# Altium project PCB_ArduinoNano.PrjPcb
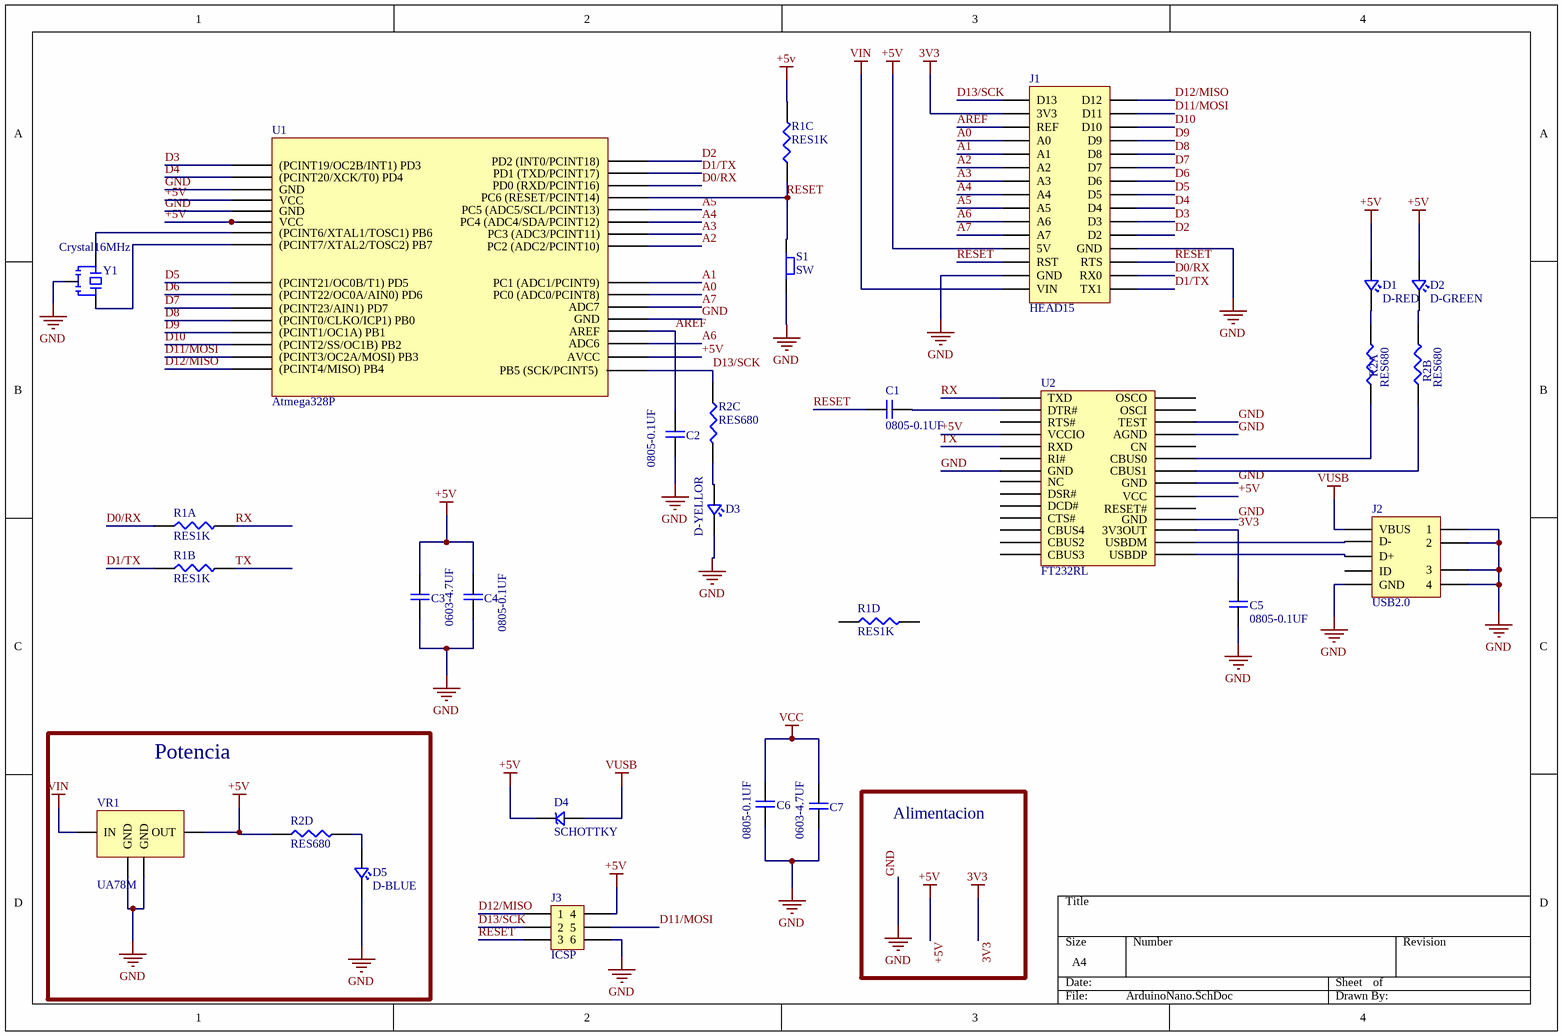
[diagram p0: ArduinoNano.SchDoc]
1 sheet, 22 parts. Net scope: global (net labels, ports and power ports of the same name join across sheets).
Board file: ArduinoNano.PcbDoc

## Sheet ArduinoNano.SchDoc
size A4

### Parts
C1  0805-0.1UF  [CAP CER0805]
C2  0805-0.1UF  [CAP CER0805]
C3  0603-4.7UF  [CAP CER0603]
C4  0805-0.1UF  [CAP CER0805]
C5  0805-0.1UF  [CAP CER0805]
C6  0805-0.1UF  [CAP CER0805]
C7  0603-4.7UF  [CAP CER0603]
D1  D-RED  [LEDR0805]
D2  D-GREEN  [LEDG0805]
D3  D-YELLOR  [LEDY0805]
D4  SCHOTTKY  [Diode Schottky]
D5  D-BLUE  [LEDB0805]
J1  HEAD15  [Headersx1]
J2  USB2.0  [USB-MINI_B]
J3  ICSP  [Headers2x3]
R1  RES1K  [RES1KX41206]  (parts A,B,C,D of 4)
R2  RES680  [RES680x4]  (parts A,B,C,D of 4)
S1  SW  [Switch]
U1  Atmega328P  [TQFP80P900X900X120-32N]
U2  FT232RL  [FT232]
VR1  UA78M  [UA78M]
Y1  Crystal16MHz  [Cristal]

### Blocks framed on the sheet
Potencia: D5 R2 VR1

### Nets
3V3: C5.1 J1.3V3 U2.17(3V3OUT)
+5V: C3.2 C4.2 D1.1 D2.1 D4.1 J1.5V J3.4 R1.6 R2.7 U1.4(VCC) U1.6(VCC) U1.18(AVCC) U2.4(VCCIO) U2.20(VCC) VR1.3(OUT)
GND: C2.1 C3.1 C4.1 C5.2 C6.2 C7.1 D3.2 D5.2 J1.GND J2.1 J2.2 J2.3 J2.4 J2.GND J3.6 S1.2 U1.3(GND) U1.5(GND) U1.21(GND) U2.7(GND) U2.18(GND) U2.21(GND) U2.25(AGND) U2.26(TEST) VR1.2(GND) VR1.4(GND) Y1.2
VCC: C6.1 C7.2
VIN: J1.VIN VR1.1(IN)
VUSB: D4.2 J2.VBUS
A0: J1.A0 U1.23(PC0_(ADC0/PCINT8))
A1: J1.A1 U1.24(PC1_(ADC1/PCINT9))
A2: J1.A2 U1.25(PC2_(ADC2/PCINT10))
A3: J1.A3 U1.26(PC3_(ADC3/PCINT11))
A4: J1.A4 U1.27(PC4_(ADC4/SDA/PCINT12))
A5: J1.A5 U1.28(PC5_(ADC5/SCL/PCINT13))
A6: J1.A6 U1.19(ADC6)
A7: J1.A7 U1.22(ADC7)
AREF: C2.2 J1.REF U1.20(AREF)
D0/RX: J1.RX0 R1.1 U1.30(PD0_(RXD/PCINT16))
D1/TX: J1.TX1 R1.3 U1.31(PD1_(TXD/PCINT17))
D2: J1.D2 U1.32(PD2_(INT0/PCINT18))
D3: J1.D3 U1.1((PCINT19/OC2B/INT1)_PD3)
D4: J1.D4 U1.2((PCINT20/XCK/T0)_PD4)
D5: J1.D5 U1.9((PCINT21/OC0B/T1)_PD5)
D6: J1.D6 U1.10((PCINT22/OC0A/AIN0)_PD6)
D7: J1.D7 U1.11((PCINT23/AIN1)_PD7)
D8: J1.D8 U1.12((PCINT0/CLKO/ICP1)_PB0)
D9: J1.D9 U1.13((PCINT1/OC1A)_PB1)
D10: J1.D10 U1.14((PCINT2/SS/OC1B)_PB2)
D11/MOSI: J1.D11 J3.5 U1.15((PCINT3/OC2A/MOSI)_PB3)
D12/MISO: J1.D12 J3.1 U1.16((PCINT4/MISO)_PB4)
D13/SCK: J1.D13 J3.2 R2.5 U1.17(PB5_(SCK/PCINT5))
RESET: C1.1 J1.RST J3.3 R1.5 S1.1 U1.29(PC6_(RESET/PCINT14))
RX: R1.2 U2.1(TXD)
TX: R1.4 U2.5(RXD)
NetC1_2: C1.2 U2.2(DTR#)
NetD1_2: D1.2 R2.2
NetD2_2: D2.2 R2.4
NetD3_1: D3.1 R2.6
NetD5_1: D5.1 R2.8
NetJ2_D+: J2.D+ U2.15(USBDP)
NetJ2_D-: J2.D- U2.16(USBDM)
NetR2_1: R2.1 U2.23(CBUS0)
NetR2_3: R2.3 U2.22(CBUS1)
NetU1_7: U1.7((PCINT6/XTAL1/TOSC1)_PB6) Y1.1
NetU1_8: U1.8((PCINT7/XTAL2/TOSC2)_PB7) Y1.3

Not connected (* = marked no-connect by the designer): J2 ID; R1 7 8; U2 3(RTS#) 6(RI#) 8(NC) 9(DSR#) 10(DCD#) 11(CTS#) 12(CBUS4) 13(CBUS2) 14(CBUS3) 19(RESET#) 24(CN) 27(OSCI) 28(OSCO)

### Notes on the sheet
- Alimentacion

### Library data of the parts
C1 C2 C4-C6 = C-CER-0.1UF
C3 C7 = CER-4.7UF-0603
D1 = LEDRED
D2 = LEDGREEN
D3 = LEDYELLOW
D4 = D-SCHOTTKY
D5 = LEDBLUE
J1 = Header1x15
J3 = Conector
S1 = SwitchSMD
U2 = FT232